# EasyEDA schematic 1-Schematic_×é777777.json
TITLE: Sheet_1; REV: 1.0; Date: 2024-02-08; Sheet: 1/1; Drawn By: qsxefvthnuk; Company: Your Company
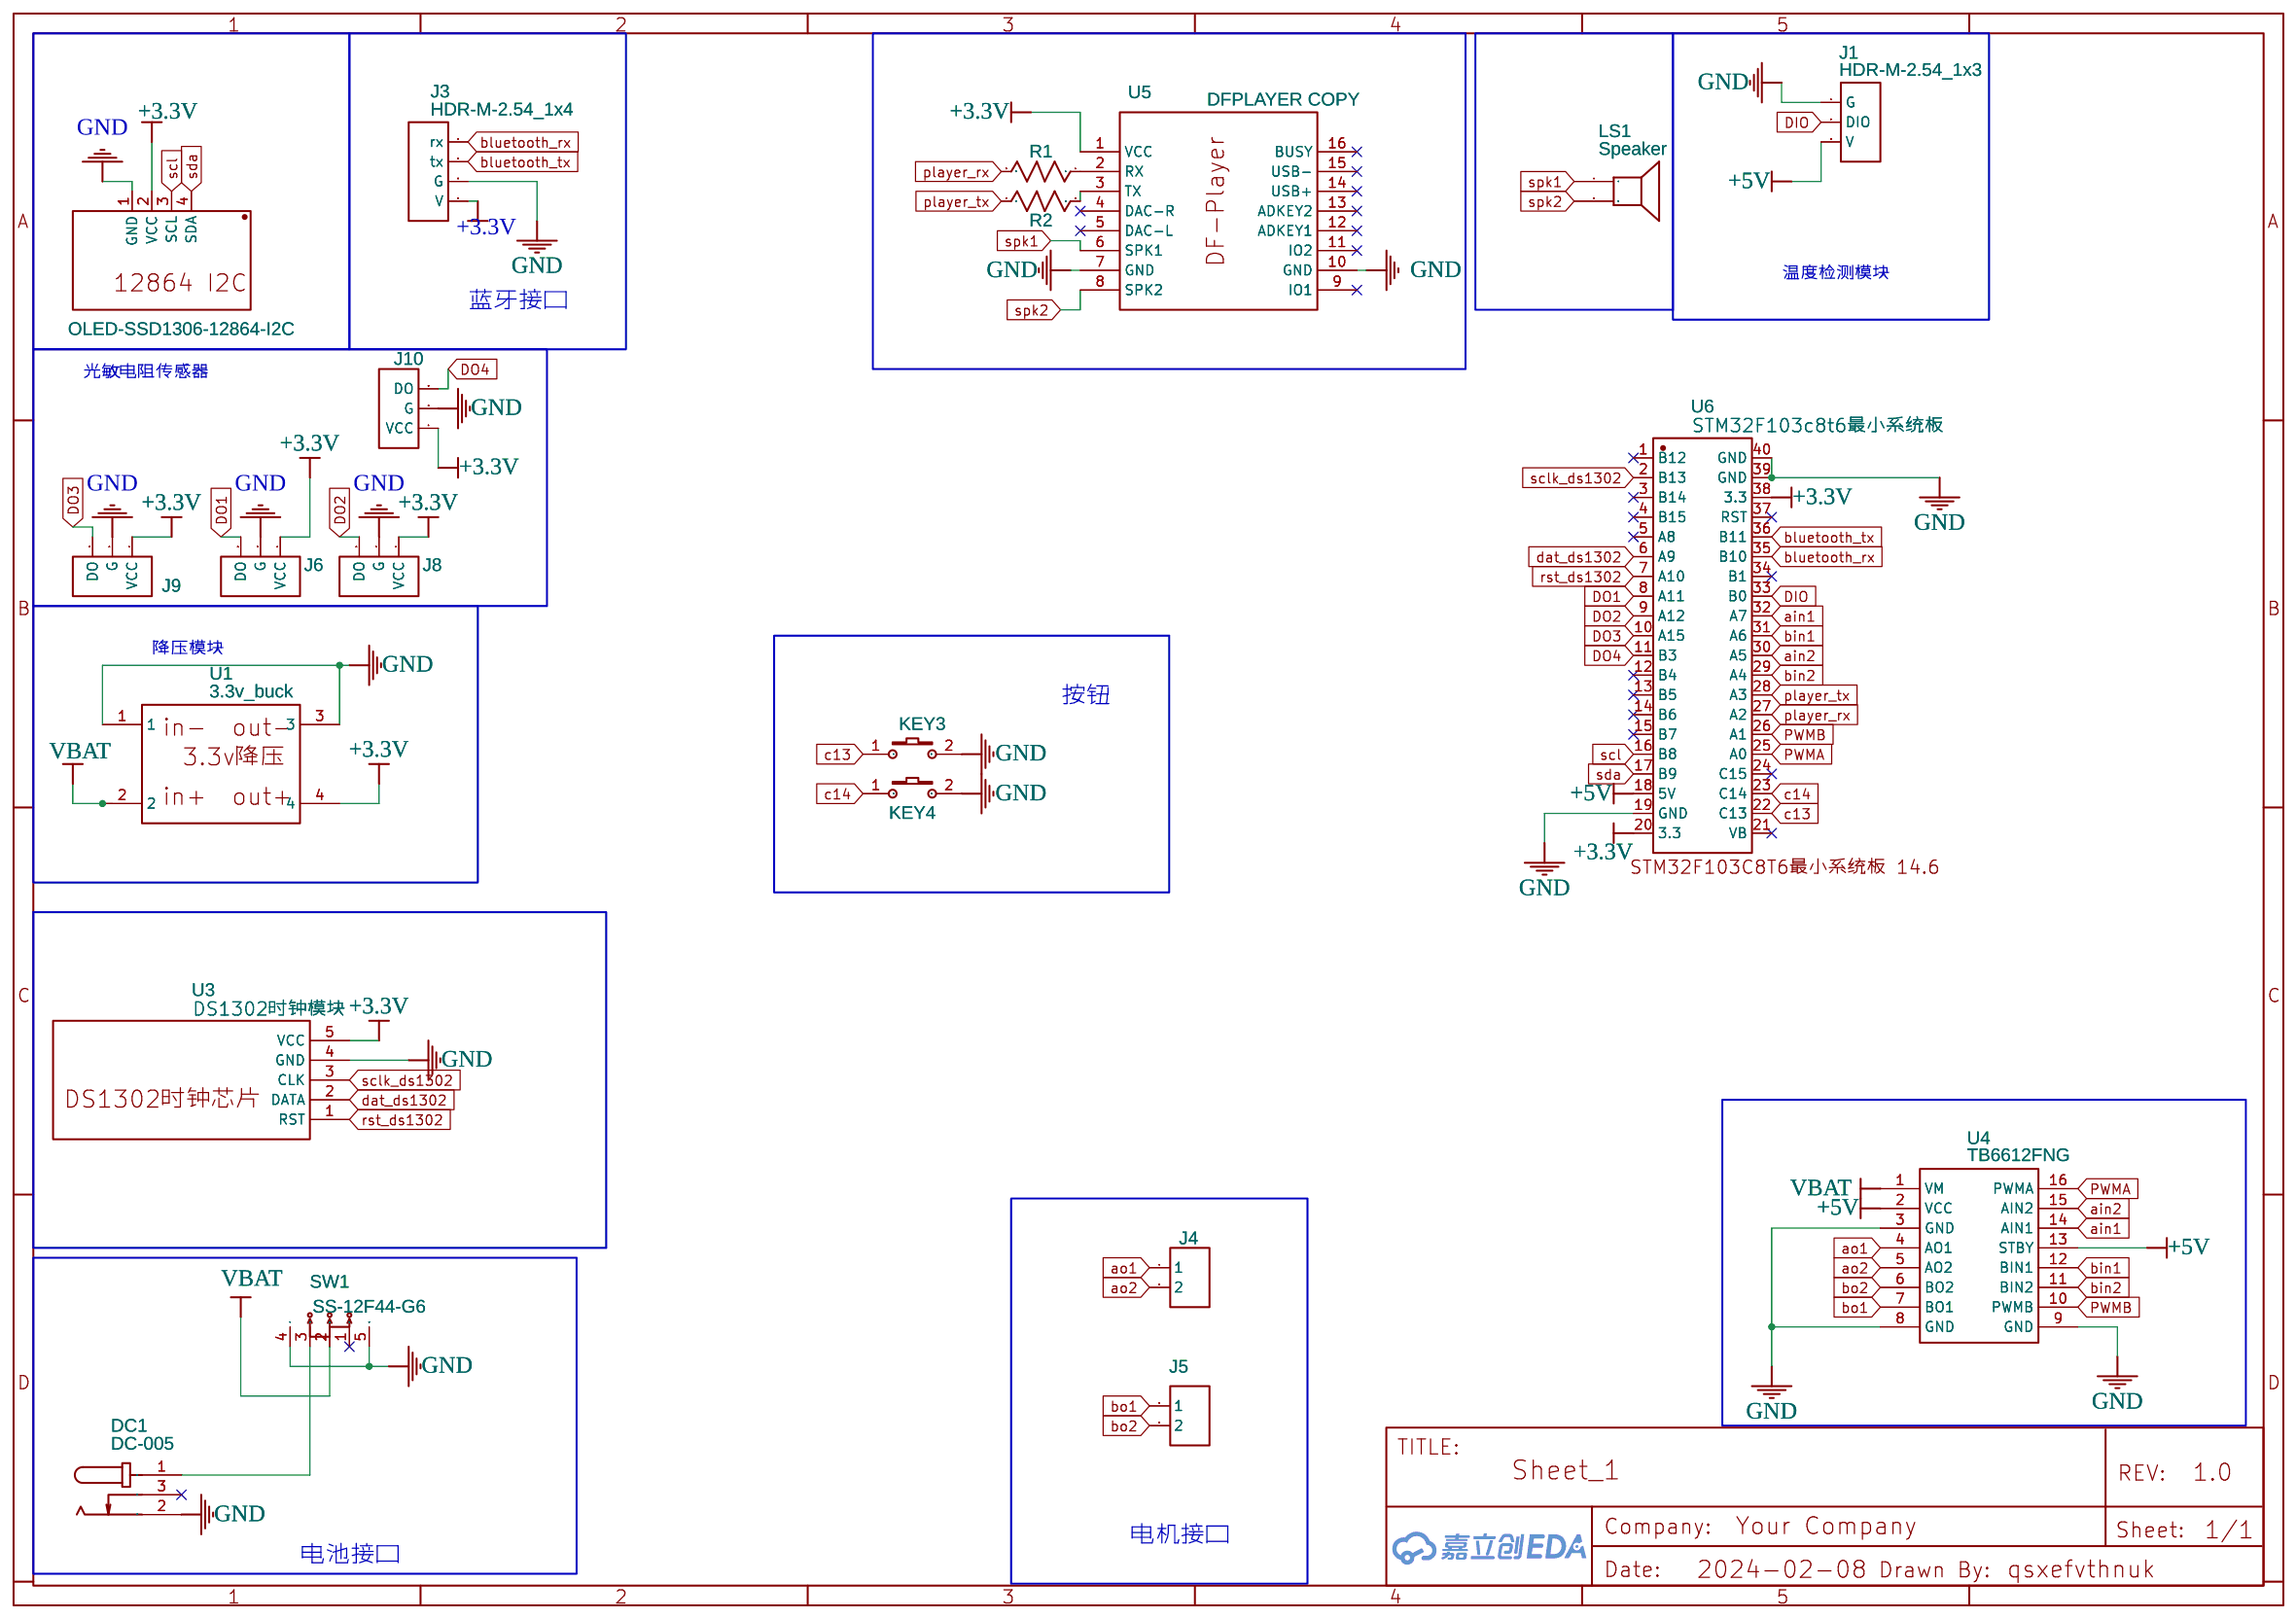
[diagram p0: schematic sheet]

## Parts
DC1  DC-005  [DC-IN-TH_DC-005-A]
J1  HDR-M-2.54_1x3  [HDR-M-2.54_1X3]
J3  HDR-M-2.54_1x4  [HDR-M-2.54_1X4]
J4  HDR-M-2.54_1x2  [HDR-M-2.54_1X2]
J5  HDR-M-2.54_1x2  [HDR-M-2.54_1X2]
J6  语音播报  [HDR-M-2.54_1X3]
J8  语音播报  [HDR-M-2.54_1X3]
J9  语音播报  [HDR-M-2.54_1X3]
J10  语音播报  [HDR-M-2.54_1X3]
KEY3  K2-3.6×6.1_SMD  [KEY-SMD_2P-L6.2-W3.6-LS8.0]
KEY4  K2-3.6×6.1_SMD  [KEY-SMD_2P-L6.2-W3.6-LS8.0]
LS1  Speaker  [HDR1X2]
PCB1  OLED-SSD1306-12864-I2C  [OLED-SSD1306-12864-I2C]
R1  1k  [R0603]
R2  1k  [R0603]
SW1  SS-12F44-G6  [SW-TH_SS-12F44-GX]
U1  3.3v_buck  [5V_BUCK]
U3  DS1302时钟模块  [DS1302时钟芯片]
U4  TB6612FNG  [TB6612FNG]
U5  DFPLAYER COPY  [DFPLAYER]
U6  STM32F103c8t6最小系统板  [STM32F103C8T6最小系统板]

## Library data of the parts
DC1 = DC-005: Contributor: LCSC; Supplier: LCSC; Supplier Part: C9900004933; Manufacturer: null; JLCPCB Part Class: Extended Part
J1 = HDR-M-2.54_1x3: Supplier Part: C180248; Supplier: LCSC; Contributor: tdddddddd
J3 = HDR-M-2.54_1x4: Supplier Part: C124378; Supplier: LCSC; Contributor: LCEDA_Lib
J4 J5 = HDR-M-2.54_1x2: Supplier Part: C124375; Supplier: LCSC; Contributor: star-spandle
J6 J8-J10 = HDR-M-2.54_1x3: Supplier Part: C180248; Supplier: LCSC; Contributor: fdsgqwt
KEY3 KEY4 = K2-3.6×6.1_SMD: Supplier Part: C118141; Supplier: LCSC; Manufacturer Part: K2-1107ST-A4SW-06; Contributor: LCEDA_Lib; 制造商: 韩国韩荣
LS1 = Speaker: Published: 24-Mar-1999; LatestRevisionDate: 17-Jul-2002; LatestRevisionNote: Re-released for DXP Platform.; PackageReference: PIN2; Publisher: Altium Limited; Contributor: ggseg
PCB1 = OLED-SSD1306-12864-I2C: sourceId: wICUcuL3l
R1 R2 = R_0603_US: Contributor: LCEDA_Lib
SW1 = SS-12F44-G6: Supplier: LCSC; Supplier Part: C698210; Manufacturer: USAKRO; Contributor: LCSC; JLCPCB Part Class: Extended Part
U1 = 5v_buck: Contributor: fsxqn
U3 = DS1302时钟模块 COPY: Contributor: L2643582910; Package Display: No
U4 = TB6612FNG: Contributor: thro
U5 = DFPLAYER COPY: Contributor: walter471114
U6 = STM32F103c8t6最小系统板: Contributor: fsxqn; Package Display: Yes

## Nets
+3.3V: J3.1(V) J6.1(VCC) J8.1(VCC) J9.1(VCC) J10.1(VCC) PCB1.2(VCC) U1.4 U3.5(VCC) U5.1(VCC) U6.20(3.3) U6.38(3.3)
+5V: J1.3(V) U4.2(VCC) U4.13(STBY) U6.18(5V)
GND: DC1.2 J1.1(G) J3.2(G) J6.2(G) J8.2(G) J9.2(G) J10.2(G) KEY3.2 KEY4.2 PCB1.1(GND) SW1.4 SW1.5 U1.1 U1.3 U3.4(GND) U4.3(GND) U4.8(GND) U4.9(GND) U5.7(GND) U5.10(GND) U6.19(GND) U6.39(GND) U6.40(GND)
VBAT: SW1.2 U1.2 U4.1(VM)
ain1: U4.14(AIN1) U6.32(A7)
ain2: U4.15(AIN2) U6.30(A5)
ao1: J4.1 U4.4(AO1)
ao2: J4.2 U4.5(AO2)
bin1: U4.12(BIN1) U6.31(A6)
bin2: U4.11(BIN2) U6.29(A4)
bluetooth_rx: J3.4(rx) U6.35(B10)
bluetooth_tx: J3.3(tx) U6.36(B11)
bo1: J5.1 U4.7(BO1)
bo2: J5.2 U4.6(BO2)
c13: KEY3.1 U6.22(C13)
c14: KEY4.1 U6.23(C14)
dat_ds1302: U3.2(DATA) U6.6(A9)
DIO: J1.2(DIO) U6.33(B0)
DO1: J6.3(DO) U6.8(A11)
DO2: J8.3(DO) U6.9(A12)
DO3: J9.3(DO) U6.10(A15)
DO4: J10.3(DO) U6.11(B3)
player_rx: R1.2 U6.27(A2)
player_tx: R2.1 U6.28(A3)
PWMA: U4.16(PWMA) U6.25(A0)
PWMB: U4.10(PWMB) U6.26(A1)
rst_ds1302: U3.1(RST) U6.7(A10)
scl: PCB1.3(SCL) U6.16(B8)
sclk_ds1302: U3.3(CLK) U6.2(B13)
sda: PCB1.4(SDA) U6.17(B9)
spk1: LS1.1 U5.6(SPK1)
spk2: LS1.2 U5.8(SPK2)
Net-(DC1-1): DC1.1 SW1.3
Net-(R1-1): R1.1 U5.2(RX)
Net-(R2-2): R2.2 U5.3(TX)

Not connected (* = marked no-connect by the designer): DC1 3*; SW1 1*; U5 4(DAC-R)* 5(DAC-L)* 9(IO1)* 11(IO2)* 12(ADKEY1)* 13(ADKEY2)* 14(USB+)* 15(USB-)* 16(BUSY)*; U6 1(B12)* 3(B14)* 4(B15)* 5(A8)* 12(B4)* 13(B5)* 14(B6)* 15(B7)* 21(VB)* 24(C15)* 34(B1)* 37(RST)*

## Notes on the sheet
- 温度检测模块
- 蓝牙接口
- 光敏电阻传感器
- 降压模块
- 按钮
- 电机接口
- 电池接口
